# EAGLE design untitled (EAGLE 9.3.0)
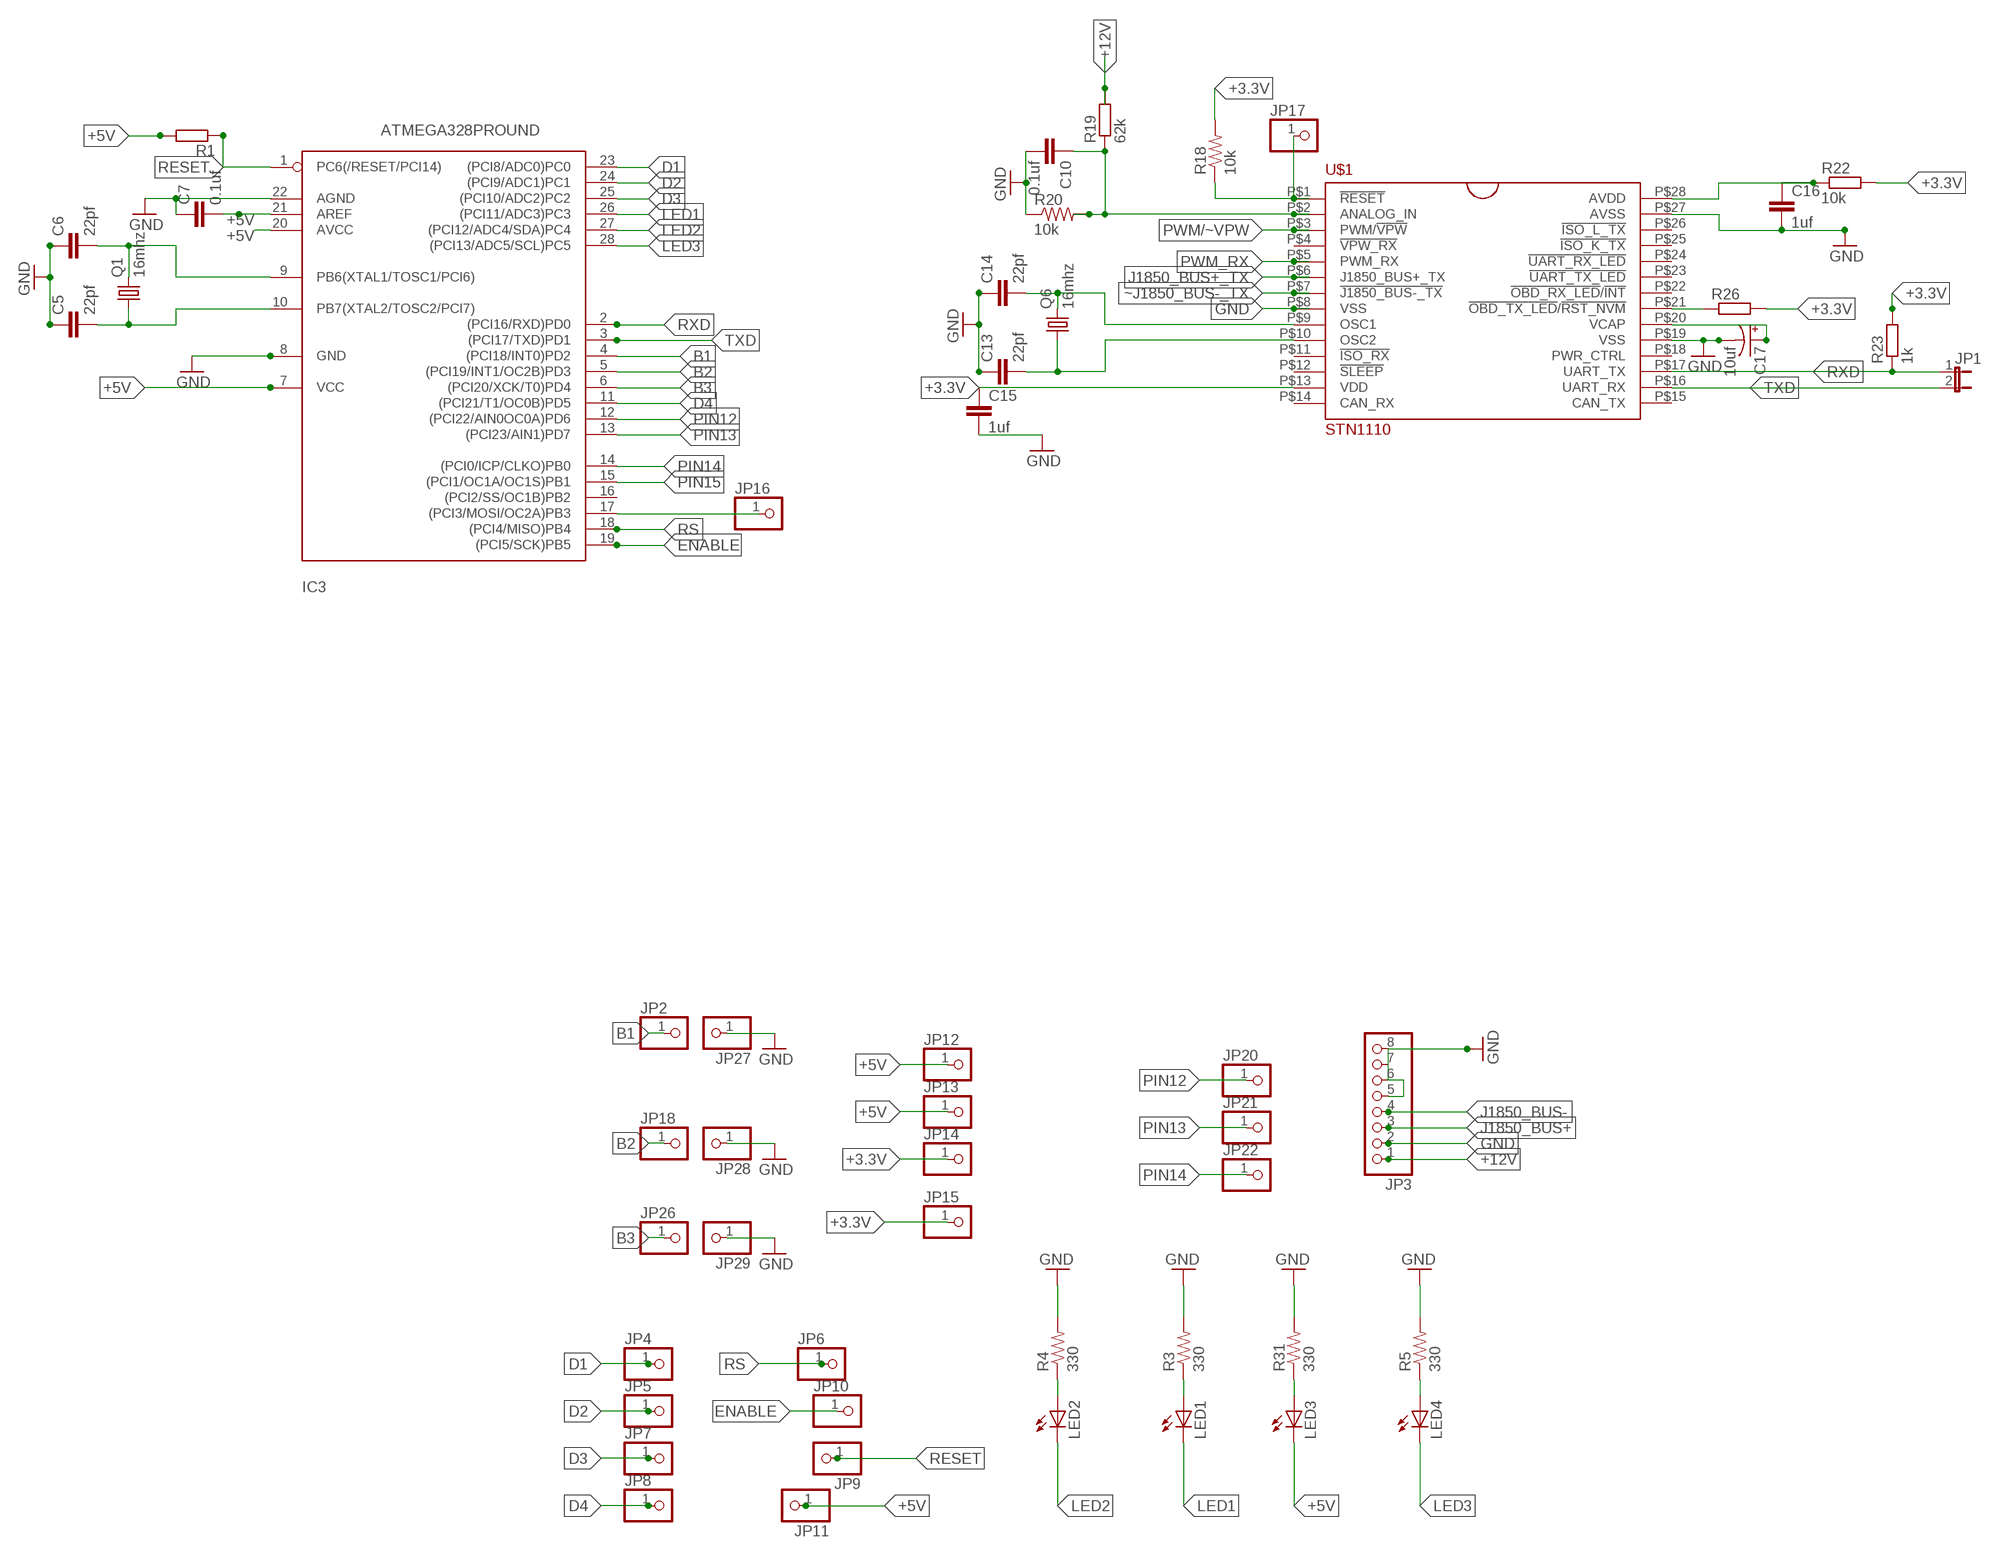
[diagram p0: schematic, sheet 1, part 1 of 2]
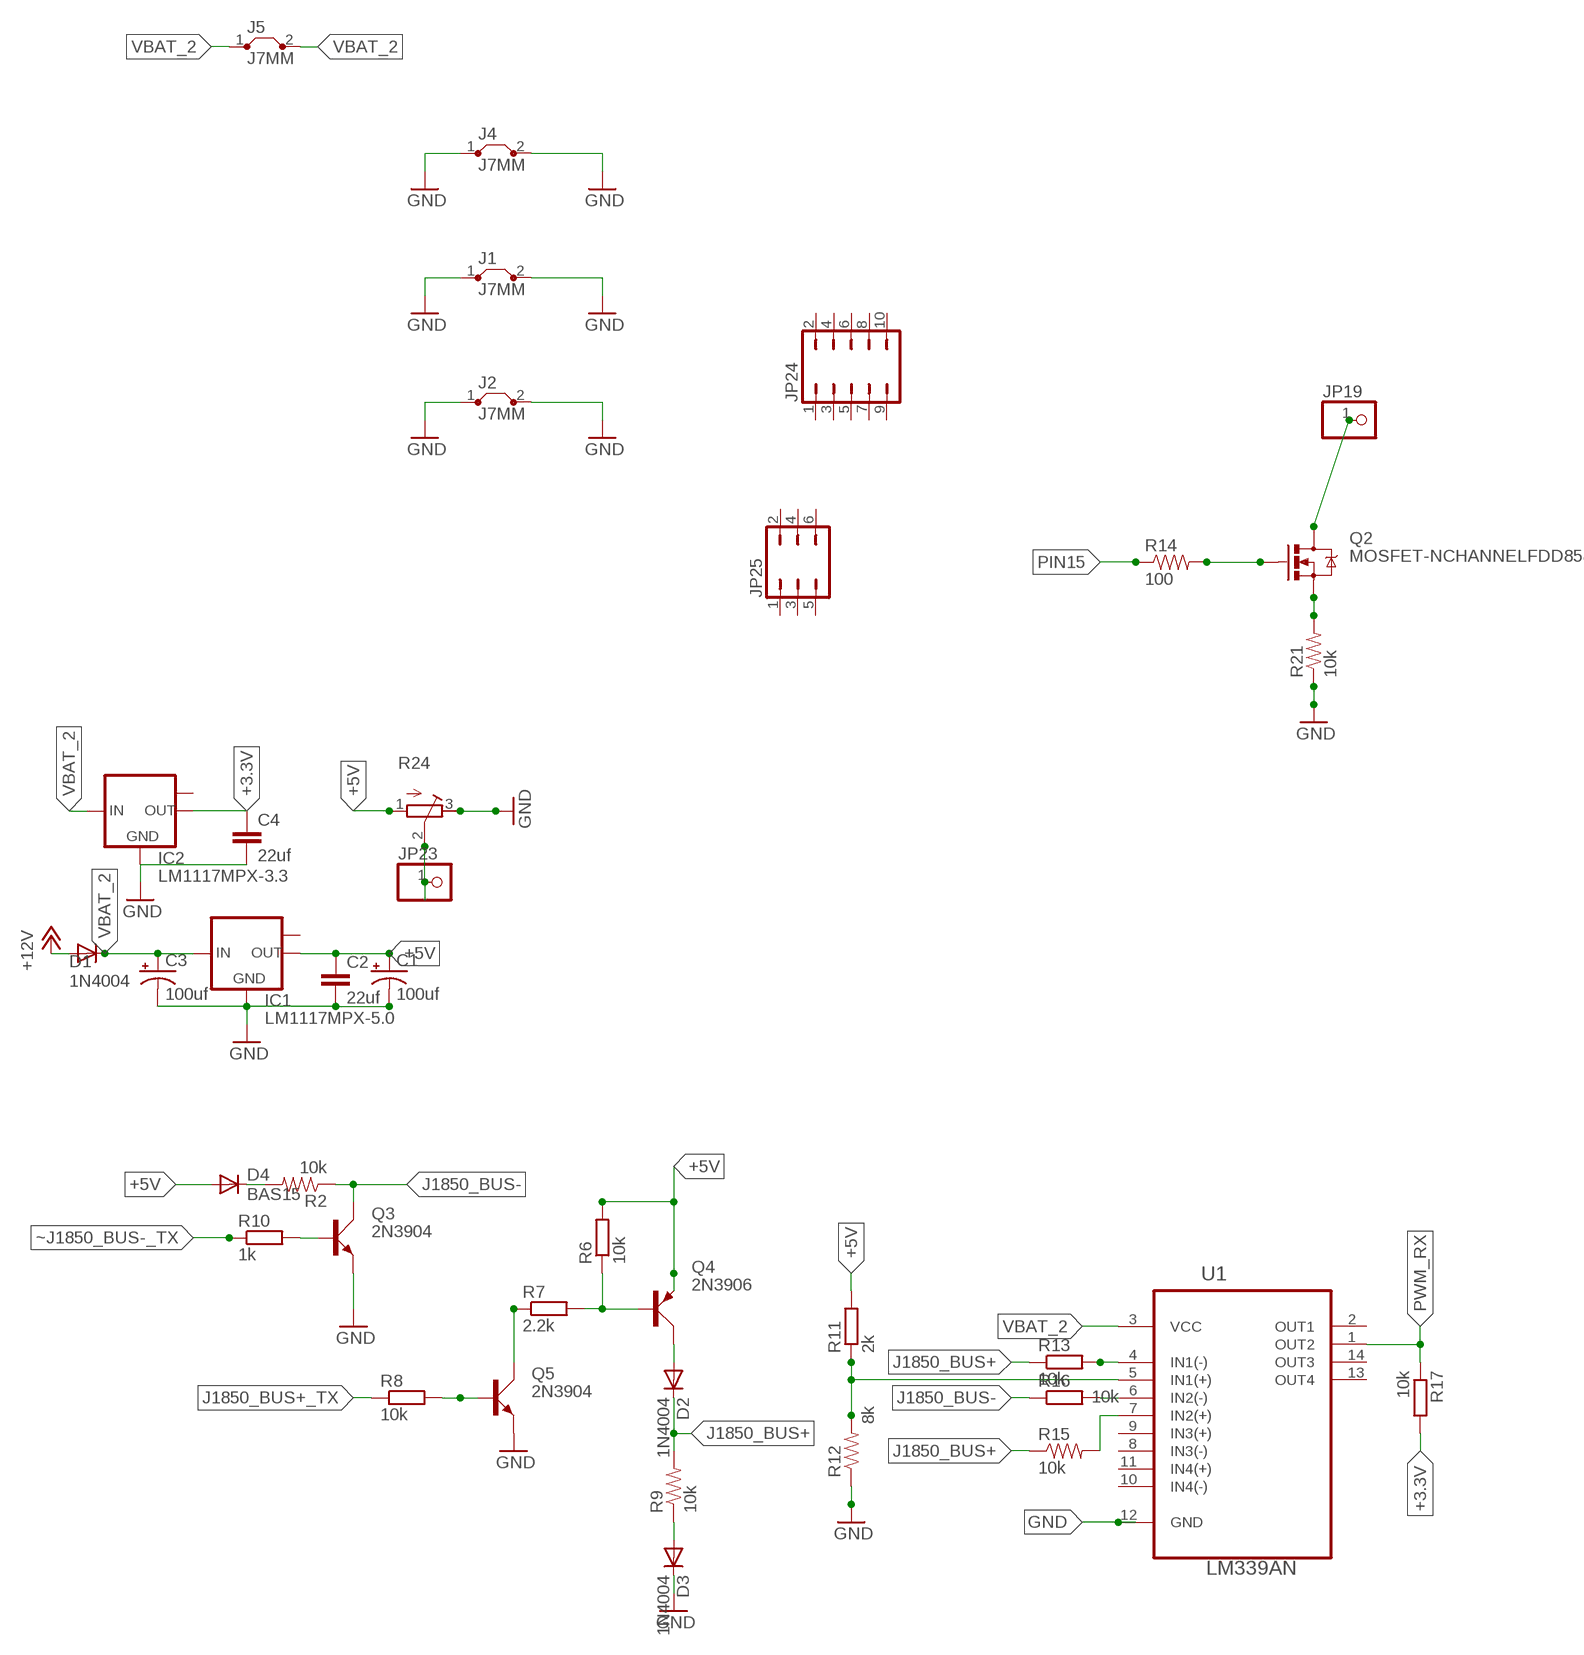
[diagram p1: schematic, sheet 1, part 2 of 2]

## Parts
C1  100uf  10UF-25V-20%(PTH)KIT  [CPOL-RADIAL-10UF-25V-KIT]
C2  22uf  C-EU025-025X050  [C025-025X050]
C3  100uf  10UF-25V-20%(PTH)KIT  [CPOL-RADIAL-10UF-25V-KIT]
C4  22uf  C-EU025-025X050  [C025-025X050]
C5  22pf  CAPPTH  [CAP-PTH-SMALL]
C6  22pf  CAPPTH  [CAP-PTH-SMALL]
C7  0.1uf  C5/4.5  [C5B4.5]
C10  0.1uf  C-EU025-025X050  [C025-025X050]
C13  22pf  CAPPTH  [CAP-PTH-SMALL]
C14  22pf  CAPPTH  [CAP-PTH-SMALL]
C15  1uf  C-EU025-025X050  [C025-025X050]
C16  1uf  C-EU025-025X050  [C025-025X050]
C17  10uf  CAP_POLPTH2  [CPOL-RADIAL-10UF-25V]
D1  1N4004  [DO41-10]
D2  1N4004  [DO41-10]
D3  1N4004  [DO41-10]
D4  BAS15  [DO34-7]
IC1  LM1117MPX-5.0  [SOT223]
IC2  LM1117MPX-3.3  [SOT223]
IC3  ATMEGA328PROUND  [DIL28-3-ROUND]
J1  J7MM  [07]
J2  J7MM  [07]
J4  J7MM  [07]
J5  J7MM  [07]
JP1  JP1E  [JP1]
JP2  PINHD-1X1  [1X01]
JP3  PINHD-1X8  [1X08]
JP4  PINHD-1X1  [1X01]
JP5  PINHD-1X1  [1X01]
JP6  PINHD-1X1  [1X01]
JP7  PINHD-1X1  [1X01]
JP8  PINHD-1X1  [1X01]
JP9  PINHD-1X1  [1X01]
JP10  PINHD-1X1  [1X01]
JP11  PINHD-1X1  [1X01]
JP12  PINHD-1X1  [1X01]
JP13  PINHD-1X1  [1X01]
JP14  PINHD-1X1  [1X01]
JP15  PINHD-1X1  [1X01]
JP16  PINHD-1X1  [1X01]
JP17  PINHD-1X1  [1X01]
JP18  PINHD-1X1  [1X01]
JP19  PINHD-1X1  [1X01]
JP20  PINHD-1X1  [1X01]
JP21  PINHD-1X1  [1X01]
JP22  PINHD-1X1  [1X01]
JP23  PINHD-1X1  [1X01]
JP24  JP5Q  [JP5Q]
JP25  JP3Q  [JP3Q]
JP26  PINHD-1X1  [1X01]
JP27  PINHD-1X1  [1X01]
JP28  PINHD-1X1  [1X01]
JP29  PINHD-1X1  [1X01]
LED1  LED3MM  [LED3MM]
LED2  LED3MM  [LED3MM]
LED3  LED5MM  [LED5MM]
LED4  LED3MM  [LED3MM]
Q1  16mhz  CRYSTALHC49S  [HC49/S]
Q2  MOSFET-NCHANNELFDD8580  [DPAK]
Q3  2N3904  [TO92D]
Q4  2N3906  [TO92D]
Q5  2N3904  [TO92D]
Q6  16mhz  CRYSTALHC49S  [HC49/S]
R1  R-EU_0207/12  [0207/12]
R2  10k  1KOHM-1/4W-1%(PTH)VERT-KIT  [AXIAL-0.1EZ]
R3  330  RESISTORPTH-1/4W-VERT-KIT  [AXIAL-0.1EZ]
R4  330  RESISTORPTH-1/4W-VERT-KIT  [AXIAL-0.1EZ]
R5  330  RESISTORPTH-1/4W-VERT-KIT  [AXIAL-0.1EZ]
R6  10k  R-EU_0204/7  [0204/7]
R7  2.2k  R-EU_0207/12  [0207/12]
R8  10k  R-EU_0207/10  [0207/10]
R9  10k  10KOHM-1/4W-1%(PTH)VERT-KIT  [AXIAL-0.1EZ]
R10  1k  R-EU_0207/12  [0207/12]
R11  2k  R-EU_0207/10  [0207/10]
R12  8k  10KOHM-1/4W5%(PTH)VERT-KIT  [AXIAL-0.1EZ]
R13  10k  R-EU_0207/10  [0207/10]
R14  100  10KOHM-1/4W-1%(PTH)VERT-KIT  [AXIAL-0.1EZ]
R15  10k  10KOHM-1/4W5%(PTH)VERT-KIT  [AXIAL-0.1EZ]
R16  10k  R-EU_0207/10  [0207/10]
R17  10k  R-EU_0207/12  [0207/12]
R18  10k  10KOHM-1/4W5%(PTH)HORIZ-KIT  [AXIAL-0.3EZ]
R19  62k  R-EU_0207/12  [0207/12]
R20  10k  1KOHM-1/4W-1%(PTH)VERT-KIT  [AXIAL-0.1EZ]
R21  10k  10KOHM-1/4W5%(PTH)VERT-KIT  [AXIAL-0.1EZ]
R22  10k  R-EU_0204/7  [0204/7]
R23  1k  R-EU_0207/10  [0207/10]
R24  R-TRIMM74W  [RTRIM74W]
R26  R-EU_M3516  [M3516]
R31  330  RESISTORPTH-1/4W-VERT-KIT  [AXIAL-0.1EZ]
U1  LM339AN  [DIP254P762X508-14]
U$1  STN1110  [SPDIP28]

## Nets
+3.3V: C4.1 C15.1 IC2.2(OUT) JP14.1 JP15.1 R17.2 R18.P$2 R22.2 R23.2 R26.2 U$1.P$13(VDD)
+5V: C1.1(+) C2.1 C7.2 D4.A IC1.2(OUT) IC3.7(VCC) IC3.20(AVCC) IC3.21(AREF) JP11.1 JP12.1 JP13.1 LED3.K(C) Q4.E R1.2 R6.2 R11.2 R24.1(E)
+12V: D1.A JP3.1 R19.2
AAA: C10.1 R19.1 R20.P$2 U$1.P$2(ANALOG_IN)
B1: IC3.4((PCI18/INT0)PD2) JP2.1
B2: IC3.5((PCI19/INT1/OC2B)PD3) JP18.1
B3: IC3.6((PCI20/XCK/T0)PD4) JP26.1
D1: IC3.23((PCI8/ADC0)PC0) JP4.1
D2: IC3.24((PCI9/ADC1)PC1) JP5.1
D3: IC3.25((PCI10/ADC2)PC2) JP7.1
D4: IC3.11((PCI21/T1/OC0B)PD5) JP8.1
ENABLE: IC3.19((PCI5/SCK)PB5) JP10.1
GND: C1.2(-) C2.2 C3.2(-) C4.2 C5.1 C6.1 C7.1 C10.2 C13.1 C14.1 C15.2 C16.2 C17.2(-) D3.C IC1.1(GND) IC2.1(GND) IC3.8(GND) IC3.22(AGND) J1.1 J1.2 J2.1 J2.2 J4.1 J4.2 JP3.2 JP3.5 JP3.6 JP3.7 JP3.8 JP27.1 JP28.1 JP29.1 Q3.E Q5.E R3.P$2 R4.P$2 R5.P$2 R12.P$1 R20.P$1 R21.P$1 R24.3(A) R31.P$2 U1.12(GND) U$1.P$8(VSS) U$1.P$19(VSS) U$1.P$27(AVSS)
J1850_BUS+: D2.C JP3.3 R9.P$2 R13.1 R15.P$1
J1850_BUS+_TX: R8.1 U$1.P$6(J1850_BUS+_TX)
J1850_BUS-: JP3.4 Q3.C R2.P$1 R16.1
LED1: IC3.26((PCI11/ADC3)PC3) LED1.K(C)
LED2: IC3.27((PCI12/ADC4/SDA)PC4) LED2.K(C)
LED3: IC3.28((PCI13/ADC5/SCL)PC5) LED4.K(C)
N$1: R26.1 U$1.P$21(!OBD_TX_LED!/!RST_NVM!)
N$2: D4.C R2.P$2
N$3: Q4.B R6.1 R7.2
N$4: R13.2 U1.4(IN1(-))
N$8: Q5.C R7.1
N$9: D2.A Q4.C
N$10: Q5.B R8.2
N$11: Q3.B R10.2
N$12: D3.A R9.P$1
N$13: R15.P$2 U1.7(IN2(+))
N$14: C16.1 R22.1 U$1.P$28(AVDD)
N$16: R16.2 U1.6(IN2(-))
N$20: C6.2 IC3.9(PB6(XTAL1/TOSC1/PCI6)) Q1.2
N$22: R11.1 R12.P$2 U1.5(IN1(+))
N$23: C5.2 IC3.10(PB7(XTAL2/TOSC2/PCI7)) Q1.1
N$26: C17.1(+) U$1.P$20(VCAP)
N$27: C14.2 Q6.2 U$1.P$9(OSC1)
N$28: C13.2 Q6.1 U$1.P$10(OSC2)
N$29: LED3.A R31.P$1
N$31: LED1.A R3.P$1
N$34: JP17.1 R18.P$1 U$1.P$1(!RESET!)
N$38: LED2.A R4.P$1
N$39: LED4.A R5.P$1
N$45: IC3.17((PCI3/MOSI/OC2A)PB3) JP16.1
N$46: Q2.1(G) R14.P$2
N$49: Q2.3(S) R21.P$2
N$50: JP23.1 R24.2(S)
N$51: JP19.1 Q2.4(D)
PIN12: IC3.12((PCI22/AIN0OC0A)PD6) JP20.1
PIN13: IC3.13((PCI23/AIN1)PD7) JP21.1
PIN14: IC3.14((PCI0/ICP/CLKO)PB0) JP22.1
PIN15: IC3.15((PCI1/OC1A/OC1S)PB1) R14.P$1
PWM/~VPW: U$1.P$3(PWM/!VPW!)
PWM_RX: R17.1 U1.1(OUT2) U$1.P$5(PWM_RX)
RESET: IC3.1(PC6(/RESET/PCI14)) JP9.1 R1.1
RS: IC3.18((PCI4/MISO)PB4) JP6.1
RXD: IC3.2((PCI16/RXD)PD0) JP1.1 R23.1 U$1.P$17(UART_TX)
TXD: IC3.3((PCI17/TXD)PD1) JP1.2 U$1.P$16(UART_RX)
VBAT_2: C3.1(+) D1.C IC1.3(IN) IC2.3(IN) J5.1 J5.2 U1.3(VCC)
~J1850_BUS-_TX: R10.1 U$1.P$7(!J1850_BUS-_TX!)
Unconnected: IC1.TAB(OUT1) IC2.TAB(OUT1) IC3.16((PCI2/SS/OC1B)PB2) JP24.1 JP24.2 JP24.3 JP24.4 JP24.5 JP24.6 JP24.7 JP24.8 JP24.9 JP24.10 JP25.1 JP25.2 JP25.3 JP25.4 JP25.5 JP25.6 U1.2(OUT1) U1.8(IN3(-)) U1.9(IN3(+)) U1.10(IN4(-)) U1.11(IN4(+)) U1.13(OUT4) U1.14(OUT3) U$1.P$4(!VPW_RX!) U$1.P$11(!ISO_RX!) U$1.P$12(!SLEEP!) U$1.P$14(CAN_RX) U$1.P$15(CAN_TX) U$1.P$18(PWR_CTRL) U$1.P$22(!OBD_RX_LED!/!INT!) U$1.P$23(!UART_TX_LED!) U$1.P$24(!UART_RX_LED!) U$1.P$25(!ISO_K_TX!) U$1.P$26(!ISO_L_TX!)

## Library data of the parts
C1 C3 = SparkFun-Capacitors:10UF-25V-20%(PTH): CAP-08440; PROD_ID: CAP-08440
C2 C4 C10 C15 C16 = resistor:C-EU: CAPACITOR, European symbol
C5 C6 C13 C14 = SparkFun-Capacitors:CAP: Capacitor Standard 0603 ceramic capacitor, and 0.1" leaded capacitor.
C7 = capacitor-wima:C: CAPACITOR naming: grid - package width
C17 = SparkFun-Capacitors:CAP_POL: Capacitor Polarized These are standard SMD and PTH capacitors. Normally 10uF, 47uF, and 100uF in electrolytic and tantalum varieties. Always verify the external diameter of the through hole cap, it varies with capacity, voltage, and manufacturer. The EIA devices should be standard.
D1-D3 = diode:1N4004: DIODE general purpose rectifier, 1 A
D4 = diode:BAS15: DIODE high speed
IC1 IC2 = lm1117:LM1117MPX-*
IC3 = atmega328:ATMEGA328*P: MICROCONTROLLER 32 kBytes FLASH 2 kBytes SRAM 1 kBytes EEPROM USART 8-channel 10 bit ADC
J1 J2 J4 J5 = jumper1:J: Bridge
JP1 = jumper:JP1E: JUMPER
JP2 JP4-JP23 JP26-JP29 = pinhead:PINHD-1X1: PIN HEADER
JP3 = pinhead:PINHD-1X8: PIN HEADER
JP24 = jumper:JP5Q: JUMPER
JP25 = jumper:JP3Q: JUMPER
LED1-LED4 = led:LED: LED OSRAM: - CHIPLED LG R971, LG N971, LY N971, LG Q971, LY Q971, LO R971, LY R971 LH N974, LH R974 LS Q976, LO Q976, LY Q976 LO Q996 - Hyper CHIPLED LW Q18S LB Q993, LB Q99A, LB R99A - SideLED LS A670, LO A670, LY A670, LG A670, LP A670 LB A673, LV A673, LT A673, LW A673 LH A674 LY A675 LS A676, LA A676, LO A676, LY A676, LW A676 LS A679, LY A679, LG A679 - Hyper Micro SIDELED® LS Y876, LA Y876, LO Y876, LY Y876 LT Y87S - SmartLED LW L88C, LW L88S LB L89C, LB L89S, LG L890 LS L89K, LO L89K, LY L89K LS L896, LA L896, LO L896, LY L896 - TOPLED LS T670, LO T670, LY T670, LG T670, LP T670 LSG T670, LSP T670, LSY T670, LOP T670, LYG T670 LG T671, LOG T671, LSG T671 LB T673, LV T673, LT T673, LW T673 LH T674 LS T676, LA T676, LO T676, LY T676, LB T676, LH T676, LSB T676, LW T676 LB T67C, LV T67C, LT T67C, LS T67K, LO T67K, LY T67K, LW E67C LS E67B, LA E67B, LO E67B, LY E67B, LB E67C, LV E67C, LT E67C LW T67C LS T679, LY T679, LG T679 LS T770, LO T770, LY T770, LG T770, LP T770 LB T773, LV T773, LT T773, LW T773 LH T774 LS E675, LA E675, LY E675, LS T675 LS T776, LA T776, LO T776, LY T776, LB T776 LHGB T686 LT T68C, LB T68C - Hyper Mini TOPLED® LB M676 - Mini TOPLED Santana® LG M470 LS M47K, LO M47K, LY M47K Source: http://www.osram.convergy.de LUXEON: - LUMILED® LXK2-PW12-R00, LXK2-PW12-S00, LXK2-PW14-U00, LXK2-PW14-V00 LXK2-PM12-R00, LXK2-PM12-S00, LXK2-PM14-U00 LXK2-PE12-Q00, LXK2-PE12-R00, LXK2-PE12-S00, LXK2-PE14-T00, LXK2-PE14-U00 LXK2-PB12-K00, LXK2-PB12-L00, LXK2-PB12-M00, LXK2-PB14-N00, LXK2-PB14-P00, LXK2-PB14-Q00 LXK2-PR12-L00, LXK2-PR12-M00, LXK2-PR14-Q00, LXK2-PR14-R00 LXK2-PD12-Q00, LXK2-PD12-R00, LXK2-PD12-S00 LXK2-PH12-R00, LXK2-PH12-S00 LXK2-PL12-P00, LXK2-PL12-Q00, LXK2-PL12-R00 Source: www.luxeon.com KINGBRIGHT: KA-3528ASYC Source: www.kingbright.com
Q1 Q6 = crystal:CRYSTAL: CRYSTAL; OC_FARNELL: 1667008; OC_NEWARK: unknown
Q2 = fets:MOSFET-NCHANNEL: Generic NMOS footprint
Q3 Q5 = transistor-small-signal:2N3904: NPN TRANSISTOR
Q4 = transistor-small-signal:2N3906: PNP TRANSISTOR
R1 = resistor:R-EU_: RESISTOR, European symbol
R2 R20 = SparkFun-Resistors:1KOHM-1/4W-1%(PTH): RES-12182; PROD_ID: RES-12182; VALUE: 1K
R3-R5 R31 = SparkFun-Resistors:RESISTOR: Resistor Basic schematic elements and footprints for 0603, 1206, and PTH resistors.
R6-R8 R10 R11 R13 R16 R17 R19 R22 R23 R26 = rcl:R-EU_: RESISTOR, European symbol
R9 = SparkFun-Resistors:10KOHM-1/4W-1%(PTH): RES-12183; PROD_ID: RES-12183
R12 = SparkFun-Resistors:10KOHM-1/4W5%(PTH): RES-09435; PROD_ID: RES-9435; VALUE: 10k
R14 = SparkFun-Resistors:10KOHM-1/4W-1%(PTH): RES-12183; PROD_ID: RES-12183; VALUE: 10k
R15 R18 R21 = SparkFun-Resistors:10KOHM-1/4W5%(PTH): RES-09435; PROD_ID: RES-9435
R24 = resistor:R-TRIMM: Trimm resistor
U1 = Fairchild_By_element14_Batch_1:LM339AN: Comparator; MPN: LM339AN; OC_FARNELL: 1564966; OC_NEWARK: 58K8938; PACKAGE: PDIP-14; SUPPLIER: Fairchild
U$1 = scantool:STN1110: STN1110 Multiprotocol OBD to UART Interpreter Datasheet can be downloaded from Scanntool <http://www.scantool.net/scantool/downloads/97/stn1110-ds.pdf>.

## Net classes
0 default: width 0.6 mm, drill 0.8 mm, clearance 1 mm

## Board
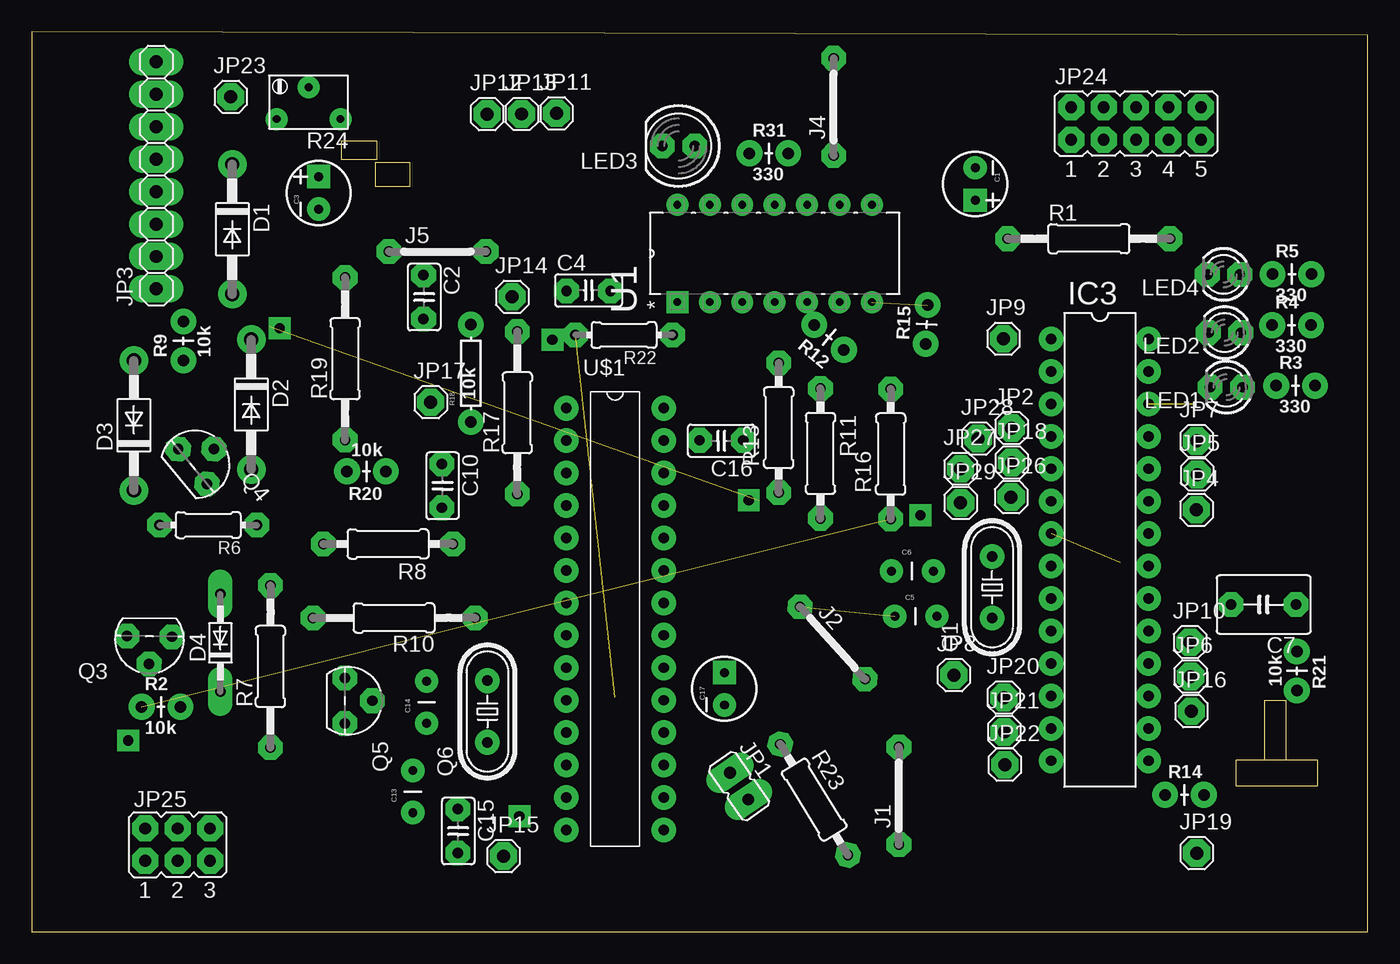
[diagram p2: board, top side]
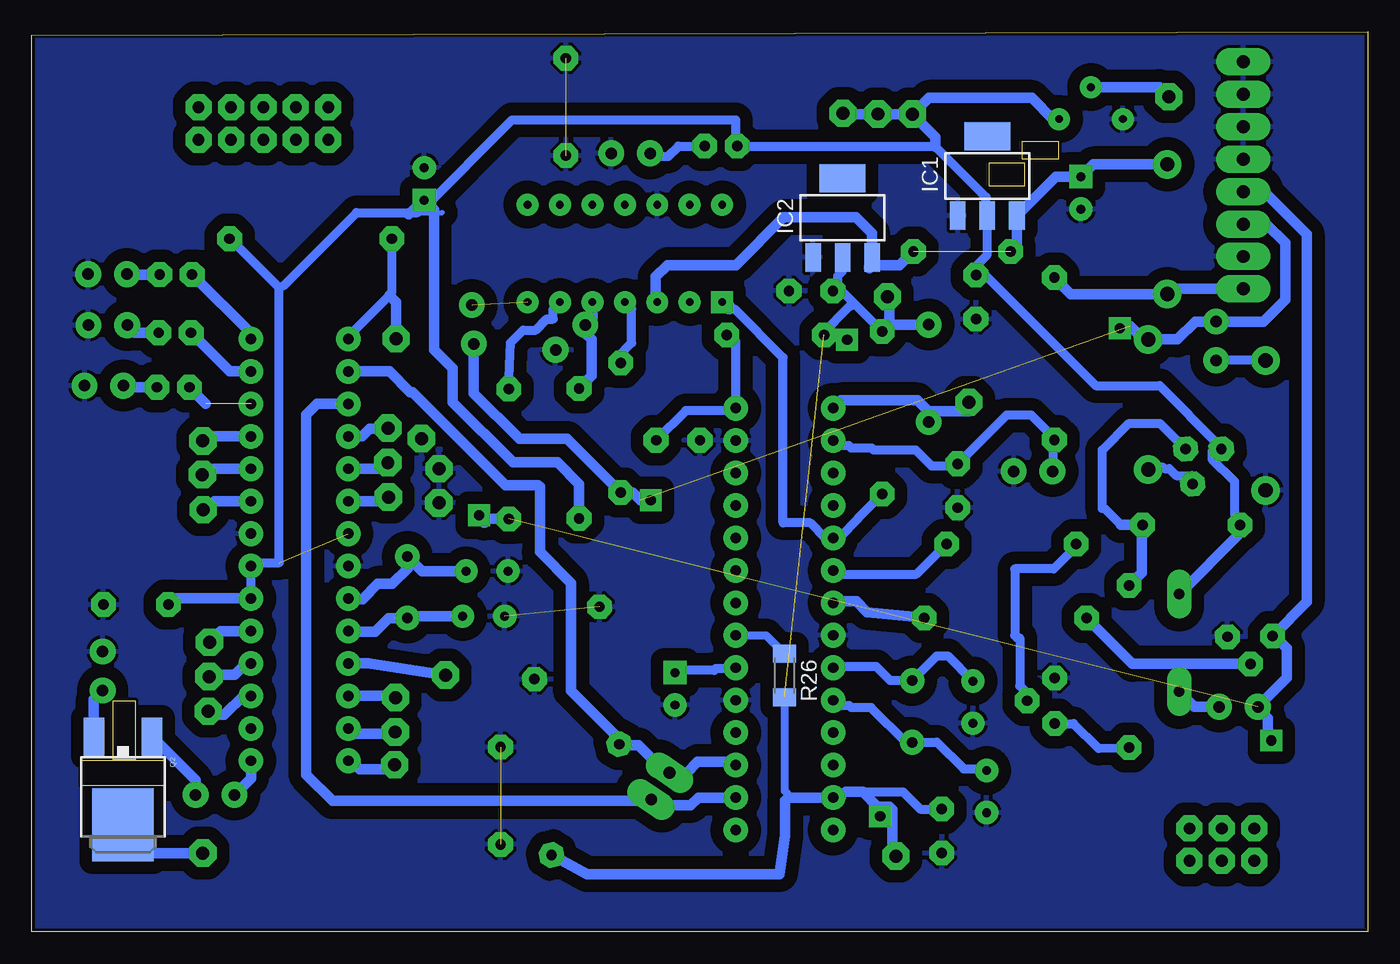
[diagram p3: board, bottom side, seen from below]

Size 104.6 x 70.45 mm. Coordinates in mm from the lower left corner, seen from the top.
Outline: 0,0 104.6,0 104.6,70.2 0,70.45 0,0
Copper layers (1*16): Top 0.035mm / dielectric 1.5mm / Bottom 0.035mm
Design rules "default *": minimum track width 0.9mm, minimum drill 0.9mm, track to track 15mil, track to pad 15mil, pad to pad 15mil, via to via 8mil, smd to smd 8mil, copper to edge 10mil, drill to drill 8mil, minimum pad ring 22mil, minimum via ring 18mil, stop-mask expansion 4mil, vias tented up to drill 10mil, thermal gap 10mil

### Footprints (pad centres in the part's own frame; a part is rotated, then mirrored left to right if it is on the bottom)
CPOL-RADIAL-10UF-25V-KIT = drill 0.7 pad 1.651 square: 1 1.27,0 | drill 0.7 pad 1.651: 2 -1.27,0
C025-025X050 = drill 0.813 octagon: 1 -1.52,-0.05; 2 1.92,-0.05
CAP-PTH-SMALL = drill 0.7 pad 1.651: 1 -0.3,0; 2 2.99,0
C5B4.5 = drill 0.813 pad 1.6 octagon: 1 -2.54,0; 2 2.54,0
CPOL-RADIAL-10UF-25V = drill 0.7 pad 1.651 square: 1 1.27,0 | drill 0.7 pad 1.651: 2 -1.27,0
DO41-10 = drill 1.118: A 5.08,0; C -5.08,0
DO34-7 = drill 0.813 long: A 3.81,0; C -3.81,0
SOT223 = smd 1.219 x 2.235: 1 -2.311,-3.099; 2 0,-3.099; 3 2.311,-3.099 | smd 3.6 x 2.2: TAB 0,3.099
DIL28-3-ROUND = drill 0.813 pad 1.676: 1 -16.51,-3.81; 2 -13.97,-3.81; 3 -11.43,-3.81; 4 -8.89,-3.81; 5 -6.35,-3.81; 6 -3.81,-3.81; 7 -1.27,-3.81; 8 1.27,-3.81; 9 3.81,-3.81; 10 6.35,-3.81; 11 8.89,-3.81; 12 11.43,-3.81; 13 13.97,-3.81; 14 16.51,-3.81; 15 16.51,3.81; 16 13.97,3.81; 17 11.43,3.81; 18 8.89,3.81; 19 6.35,3.81; 20 3.81,3.81; 21 1.27,3.81; 22 -1.27,3.81; 23 -3.81,3.81; 24 -6.35,3.81; 25 -8.89,3.81; 26 -11.43,3.81; 27 -13.97,3.81; 28 -16.51,3.81
07 = drill 0.813 pad 1.6 octagon: 1 -3.81,0; 2 3.81,0
JP1 = drill 0.914 long: 1 0,-1.27; 2 0,1.27
1X01 = drill 1.016 octagon: 1 0,0
1X08 = drill 1.016 long: 1 -8.89,0; 2 -6.35,0; 3 -3.81,0; 4 -1.27,0; 5 1.27,0; 6 3.81,0; 7 6.35,0; 8 8.89,0
JP5Q = drill 0.914 octagon: 1 -5.08,-1.27; 2 -5.08,1.27; 3 -2.54,-1.27; 4 -2.54,1.27; 5 0,-1.27; 6 0,1.27; 7 2.54,-1.27; 8 2.54,1.27; 9 5.08,-1.27; 10 5.08,1.27
JP3Q = drill 0.914 octagon: 1 -2.54,-1.27; 2 -2.54,1.27; 3 0,-1.27; 4 0,1.27; 5 2.54,-1.27; 6 2.54,1.27
LED3MM = drill 0.813 octagon: A -1.27,0; K 1.27,0
LED5MM = drill 0.813 octagon: A -1.27,0; K 1.27,0
HC49/S = drill 0.813: 1 -2.413,0; 2 2.413,0
DPAK = smd 1.6 x 3: 1 -2.28,-5.31; 3 2.28,-5.31 | smd 4.826 x 5.715: 4 0,1.588
TO92D = drill 0.813 octagon: B 0,1.905; C 1.77,-0.25; E -1.77,-0.25
0207/12 = drill 0.813 octagon: 1 -6.35,0; 2 6.35,0
AXIAL-0.1EZ = drill 0.9 pad 1.88: P$1 -0.25,0; P$2 2.79,0
0204/7 = drill 0.813 octagon: 1 -3.81,0; 2 3.81,0
0207/10 = drill 0.813 octagon: 1 -5.08,0; 2 5.08,0
AXIAL-0.3EZ = drill 0.9 pad 1.88: P$1 -3.81,0; P$2 3.81,0
RTRIM74W = drill 0.61: 1 -1.25,-2.5; 2 1.25,0; 3 -1.25,2.5
M3516 = smd 1.4 x 1.8: 1 -1.7,0; 2 1.7,0
DIP254P762X508-14 = drill 0.6 pad 1.27 square: 1 -7.62,15.24 | drill 0.6 pad 1.27: 2 -7.62,12.7; 3 -7.62,10.16; 4 -7.62,7.62; 5 -7.62,5.08; 6 -7.62,2.54; 7 -7.62,0; 8 0,0; 9 0,2.54; 10 0,5.08; 11 0,7.62; 12 0,10.16; 13 0,12.7; 14 0,15.24
SPDIP28 = drill 0.813 pad 1.524: P$1 -3.81,16.51; P$2 -3.81,13.97; P$3 -3.81,11.43; P$4 -3.81,8.89; P$5 -3.81,6.35; P$6 -3.81,3.81; P$7 -3.81,1.27; P$8 -3.81,-1.27; P$9 -3.81,-3.81; P$10 -3.81,-6.35; P$11 -3.81,-8.89; P$12 -3.81,-11.43; P$13 -3.81,-13.97; P$14 -3.81,-16.51; P$15 3.81,-16.51; P$16 3.81,-13.97; P$17 3.81,-11.43; P$18 3.81,-8.89; P$19 3.81,-6.35; P$20 3.81,-3.81; P$21 3.81,-1.27; P$22 3.81,1.27; P$23 3.81,3.81; P$24 3.81,6.35; P$25 3.81,8.89; P$26 3.81,11.43; P$27 3.81,13.97; P$28 3.81,16.51

### Placement (x,y rotation side)
C1  73.87,58.55 270 top
C2  30.72,49.89 270 top
C3  22.45,57.85 90 top
C4  43.39,50.22 0 top
C5  67.87,24.7 0 top
C6  67.61,28.25 0 top
C7  96.46,25.62 180 top
C10  32.16,35.12 270 top
C13  29.83,9.64 90 top
C14  30.9,16.64 90 top
C15  33.39,8.09 270 top
C16  54.2,38.44 180 top
C17  54.23,19.03 90 top
D1  15.69,55.01 270 top
D2  17.18,41.28 270 top
D3  7.98,39.65 90 top
D4  14.76,22.62 90 top
IC1  29.78,59.17 0 bottom
IC2  41.12,55.91 0 bottom
IC3  83.64,29.9 270 top
J1  67.9,10.65 90 top
J2  62.7,22.61 312 top
J4  62.78,64.58 90 top
J5  31.75,53.26 0 top
JP1  55.38,11.41 214.5 top
JP2  76.72,39.44 0 top
JP3  9.74,59.22 90 top
JP4  91.19,33.04 0 top
JP5  91.25,35.8 0 top
JP6  90.73,19.98 0 top
JP7  91.21,38.43 0 top
JP8  72.2,20.1 0 top
JP9  76.08,46.43 0 top
JP10  90.69,22.68 0 top
JP11  41.09,64.08 0 top
JP12  35.64,64.02 0 top
JP13  38.35,64.03 0 top
JP14  37.61,49.71 0 top
JP15  36.93,5.93 0 top
JP16  90.8,17.28 0 top
JP17  31.23,41.46 0 top
JP18  76.72,36.74 0 top
JP19  91.21,6.17 0 top
JP20  76.11,18.34 0 top
JP21  76.14,15.64 0 top
JP22  76.19,13.09 0 top
JP23  15.56,65.37 0 top
JP24  86.47,63.28 0 top
JP25  11.41,6.83 0 top
JP26  76.68,34.03 0 top
JP27  72.72,36.25 0 top
JP28  74.09,38.62 0 top
JP29  72.73,33.58 0 top
LED1  93.55,42.63 180 top
LED2  93.4,46.9 180 top
LED3  50.65,61.52 180 top
LED4  93.33,51.46 180 top
Q1  75.2,26.98 90 top
Q2  97.47,9.95 180 bottom
Q3  9.2,22.88 179.1 top
Q4  12.77,36.59 309.5 top
Q5  24.75,18.09 270 top
Q6  35.67,17.25 90 top
R1  82.77,54.26 0 top
R2  8.85,17.61 0 top
R3  97.69,42.76 0 top
R4  97.38,47.49 0 top
R5  97.41,51.49 0 top
R6  13.81,31.84 180 top
R7  18.68,20.77 90 top
R8  27.89,30.36 180 top
R9  11.86,44.99 90 top
R10  28.36,24.57 180 top
R11  61.75,37.45 270 top
R12  63.4,45.73 139.8 top
R13  58.48,39.47 90 top
R14  88.99,10.73 0 top
R15  70.01,46.28 87.2 top
R16  67.25,37.41 90 top
R17  38.01,40.63 90 top
R18  34.38,43.73 90 top
R19  24.53,44.87 90 top
R20  27.47,36.05 180 top
R21  99.06,21.69 270 top
R22  46.37,46.73 180 top
R23  61.26,10.35 301.4 top
R24  21.66,64.88 90 top
R26  45.66,20.08 270 bottom
R31  56.44,60.94 0 top
U1  65.79,56.92 90 top
U$1  45.67,24.48 0 top

### Tracks (layer width: path | path; a pad name or v marks a point on that pad's centre or on a via)
+3.3V  (1 unrouted)
  Bottom 0.61: R26.2 45.66,11.03 45.14,10.52
  Bottom 0.7: C15.1 35.03,9.61 36.38,10.96 40.83,10.96 41.28,10.51 41.83,10.51 U$1.P$13 | IC2.2 41.13,52.76 41.13,51.71 41.48,51.36 41.48,50.56 41.53,50.56 41.88,50.21 C4.1 41.33,50.26 41.28,50.26 40.26,49.23 | 40.26,49.23 R17.2 | R22.2 42.78,46.76 40.53,49.01 40.48,49.01 40.26,49.23
  Bottom 0.813: R18.P$2 37.46,47.53 | 37.46,47.53 R17.2 | U$1.P$13 45.14,10.52 45.38,10.52 45.62,10.27 45.62,7.54 46.05,4.52 61.13,4.52 R23.2 | 40.83,10.96 39.52,10.96 38.37,9.81 37.46,9.81 37.21,9.56 37.21,6.21 JP15.1 | R22.2 41.45,46.73 41.44,46.74 | 37.46,47.53 37.46,49.56 JP14.1
+5V  (1 unrouted)
  Bottom 0.406: 74.38,56.31 72.44,56.31
  Bottom 0.7: IC3.20 87.48,26.11 87.48,28.61 IC3.21 87.23,28.91 85.23,28.91 85.23,50.41 | R6.2 10.03,31.86 10.03,32.31 10.43,32.71 10.43,35.26 12.18,37.01 12.18,37.61 11.63,37.61 11.48,37.76 Q4.E 11.63,38.11 16.28,42.76 21.28,42.76 29.93,51.41 C2.1 30.63,51.41 30.63,52.16 29.78,53.01 29.78,56.06 IC1.2 29.88,56.41 29.88,57.51 33.83,61.46 49.28,61.46 49.33,61.51 LED3.K 49.48,61.86 49.48,63.56 66.98,63.56 74.08,56.46 74.38,56.31 74.98,56.31 79.18,56.31 84.93,50.56 85.23,50.41 | 85.23,50.41 89.08,54.26 R1.2
  Bottom 0.813: 10.03,31.86 10.03,31.16 D4.A | 87.48,26.11 93.44,26.11 C7.2 | 33.83,61.46 33.83,62.21 JP12.1 | JP12.1 JP13.1 41.03,64.03 JP11.1 | 74.98,56.31 75.09,56.2 C1.1 73.12,56.52 73.12,45.59 71.65,44.12 71.65,41.47 66.93,36.75 63.45,36.75 61.75,35.06 R11.2 | R24.1 24.64,63.63 26.3,65.29 34.37,65.29 JP12.1
+12V
  Bottom 0.813: JP3.1 15.28,50.33 D1.A 23.24,49.92 R19.2
AAA
  Bottom 0.7: U$1.P$2 41.83,38.41 41.48,38.06 40.63,38.06 40.43,37.86 38.83,37.86 38.68,37.71 35.38,37.71 34.13,36.46 32.38,36.46 C10.1 32.08,36.66 28.28,40.46 26.33,40.46 24.48,38.61 24.48,38.56 R19.1 24.63,38.21 24.63,36.06 R20.P$2
B1
  Bottom 0.813: IC3.4 78.75,38.79 78.16,39.38 76.78,39.38 JP2.1
B2
  Bottom 0.813: IC3.5 77.21,36.25 JP18.1
B3
  Bottom 0.813: IC3.6 77,33.71 JP26.1
D1
  Bottom 0.813: IC3.23 90.3,33.71 91.44,32.58 91.44,32.8 JP4.1
D2
  Bottom 0.813: IC3.24 90.81,36.25 JP5.1
D3
  Bottom 0.813: IC3.25 90.85,38.79 JP7.1
D4
  Bottom 0.813: IC3.11 78.25,21.01 JP8.1
ENABLE
  Bottom 0.813: IC3.19 89.81,23.55 JP10.1
GND  (3 unrouted)
  Bottom 0.7: IC3.22 87.48,31.21 87.48,31.17 | U$1.P$8 41.88,23.21 U$1.P$8
  pour Bottom: -3.81,102.87 -3.81,-5.08 167.64,-5.08 167.64,102.87
J1850_BUS+  (1 unrouted)
  Bottom 0.813: JP3.3 7.93,55.41 6.46,53.93 6.46,49.48 8.18,47.75 11.84,47.75 R9.P$2 13.5,47.78 14.91,46.37 17.17,46.37 D2.C 17.55,46.37 18.59,47.4 | 56.93,33.77 57.54,34.38 R13.1 62.69,38.59 66.43,38.59 70,42.16 R15.P$1
J1850_BUS+_TX
  Bottom 0.7: R8.1 32.98,30.36 35.33,28.01 41.08,28.01 41.33,28.26 41.83,28.26 U$1.P$6
J1850_BUS-  (1 unrouted)
  Bottom 0.813: JP3.4 8.1,57.95 4.76,54.62 4.76,25.82 Q3.C 7.26,23.15 6.32,22.21 6.32,19.89 R2.P$1 8.6,17.5 7.81,16.72 7.81,15.73 7.84,15.71 | R16.1 68.9,32.33 69.19,32.03 69.14,32.03
LED1  (1 unrouted)
  Bottom 0.813: 90.97,41.33 LED1.K
LED2
  Bottom 0.813: IC3.27 89.1,43.87 LED2.K
LED3
  Bottom 0.813: IC3.28 87.45,46.85 LED4.K
N$1
  Bottom 0.61: U$1.P$21 47.09,23.21 R26.1
N$2
  Bottom 0.813: R2.P$2 13.56,17.61 D4.C
N$3
  Bottom 0.7: Q4.B 14.28,37.81 16.28,39.81 18.68,39.81 20.78,37.71 20.78,33.16 20.63,33.16 19.33,31.86 17.98,31.86 R6.1
  Bottom 0.813: 19.33,31.86 17.79,31.86 17.69,31.76 17.69,28.11 R7.2
N$4
  Bottom 0.7: U1.4 58.13,49.26 57.63,48.76 57.63,46.11 58.78,44.96 58.78,44.51 58.73,44.51 R13.2
N$8
  Bottom 0.7: R7.1 21.08,14.36 23.03,16.31 24.48,16.31 Q5.C
N$9
  Bottom 0.7: Q4.C 13.73,35.11 13.73,35.71 14.98,35.71 15.53,36.26 15.93,36.26 16.08,36.41 16.93,36.41 17.13,36.21 D2.A
N$10
  Bottom 0.7: Q5.B 26.68,18.11 26.68,18.71 27.23,19.26 27.23,23.01 27.43,23.01 27.63,23.21 27.63,28.41 24.58,28.41 22.83,30.16 22.83,30.36 R8.2
N$11
  Bottom 0.813: Q3.B 18.41,20.97 R10.2
N$12
  Bottom 0.7: R9.P$1 11.83,44.76 9.03,44.76 8.98,44.71 7.98,44.71 D3.A
N$13  (1 unrouted)
N$14
  Bottom 0.7: R22.1 50.38,46.71 49.88,46.21 49.48,46.21 U$1.P$28 49.78,40.81 53.38,40.81 55.68,38.51 C16.1
N$16
  Bottom 0.7: R16.2 67.13,46.11 66.13,47.11 65.13,47.11 64.28,47.96 63.78,47.96 63.78,48.76 63.28,49.26 U1.6
N$20
  Bottom 0.813: C6.2 74.06,28.25 Q1.2 75.2,28.44 76.39,27.24 77.51,27.24 78.71,26.05 79.78,26.05 IC3.9
N$22
  Bottom 0.813: U1.5 60.71,48.09 R12.P$2 61.27,46.87 60.77,46.38 60.77,43.52 R11.1
N$23
  Bottom 0.813: C5.2 75.06,24.7 Q1.1 76.68,24.56 77.74,23.51 79.78,23.51 IC3.10
N$25  (via drill 0.8 pad 1.68)
  other vias: 7.55,14.98
N$26
  Bottom 0.7: C17.1 54.08,20.46 51.18,20.46 51.03,20.61 49.53,20.61 49.48,20.66 U$1.P$20
N$27
  Bottom 0.7: C14.2 32.88,21.61 33.73,21.61 35.63,19.71 Q6.2 35.98,19.66 37.38,19.66 38.48,20.76 41.78,20.76 41.83,20.71 U$1.P$9
N$28
  Bottom 0.7: C13.2 29.83,12.66 29.93,12.76 31.63,12.76 33.73,14.86 35.63,14.86 Q6.1 36.03,14.81 36.13,14.81 38.88,17.56 40.43,17.56 40.58,17.71 41.43,17.71 U$1.P$10
N$29
  Bottom 0.7: LED3.A 51.93,61.51 53.98,61.51 54.78,60.71 55.58,60.71 55.78,60.91 56.18,60.91 R31.P$1
N$31
  Bottom 0.813: LED1.A 97.31,42.63 R3.P$1
N$34
  Bottom 0.813: R18.P$1 34.38,40.75 | 34.38,40.75 35.23,41.61 41.24,41.61 U$1.P$1 | 34.38,40.75 31.23,40.75 JP17.1
N$38
  Bottom 0.813: LED2.A 96.55,46.9 R4.P$1
N$39
  Bottom 0.813: LED4.A 97.13,51.46 R5.P$1
N$40  (via drill 0.8 pad 1.68)
  other vias: 69.59,32.61
N$41  (via drill 0.8 pad 1.68)
  other vias: 56.13,33.8
N$42  (via drill 0.8 pad 1.68)
  other vias: 19.39,47.25
N$43  (via drill 0.8 pad 1.68)
  other vias: 38.17,9.05
N$44  (via drill 0.8 pad 1.68)
  other vias: 40.76,46.35
N$45
  Bottom 0.813: IC3.17 88.03,18.47 89.53,16.98 90.5,16.98 JP16.1
N$46
  Bottom 0.813: R14.P$2 91.78,11.85 Q2.1
N$49
  Bottom 0.813: Q2.3 99.75,18.21 R21.P$2
N$50
  Bottom 0.813: R24.2 16.32,66.13 JP23.1
N$51
  Bottom 0.813: JP19.1 96.42,6.17 96.54,6.28 96.54,7.43 Q2.4
PIN12
  Bottom 0.813: IC3.12 76.25,18.47 JP20.1
PIN13
  Bottom 0.813: IC3.13 79.7,15.93 79.28,15.52 76.28,15.52 JP21.1
PIN14
  Bottom 0.813: IC3.14 79.59,13.39 78.94,12.73 76.54,12.73 JP22.1
PIN15
  Bottom 0.813: IC3.15 87.45,12.02 R14.P$1
PWM_RX
  Bottom 0.7: 50.53,49.26 50.03,48.76 50,48.76 49.58,48.76 45.78,44.96 45.78,32.01 43.63,32.01 42.48,30.86 41.88,30.86 U$1.P$5 41.53,30.91 41.33,30.91 39.88,32.36 39.88,32.41 R17.1
  Bottom 0.9: U1.1 50,49 50,48.76
RESET
  Bottom 0.7: IC3.1 79.78,46.41 79.78,46.86 79.58,46.86 76.61,49.84 76.43,50.01 76.43,54.26 R1.1
  Bottom 0.813: 76.61,49.84 76.08,49.3 JP9.1
RS
  Bottom 0.813: IC3.18 87.83,21.01 88.73,20.11 90.61,20.11 JP6.1
RXD
  Bottom 0.813: U$1.P$17 49.72,13.3 52.46,13.3 53.3,12.46 JP1.1 54.94,12.46 57.09,14.61 58.11,14.61 | 58.11,14.61 58.53,14.61 R23.1 | IC3.2 76.6,43.87 74.99,42.26 74.79,42.26 67.51,34.98 64.96,34.98 64.82,34.84 64.82,29.74 62.39,27.31 62.39,18.89 58.11,14.61
TXD
  Bottom 0.813: U$1.P$16 52.41,10.52 53.02,9.91 55.65,9.91 JP1.2 56.21,10.26 81.05,10.26 83.11,12.32 83.11,40.47 82.25,41.33 IC3.3
VBAT_2  (1 unrouted)
  Bottom 0.813: D1.C 21.49,60.09 C3.1 24.42,59.12 IC1.3 27.47,53.73 J5.1 | J5.2 36.65,52.17 38.84,52.17 | IC2.3 38.81,54.68 40.06,55.94 45.74,55.94 49.48,52.2 54.82,52.2 55.76,51.27 55.76,49.43 U1.3
  Bottom 0.9: 38.84,52.17 39,52 IC2.3
~J1850_BUS-_TX
  Bottom 0.813: R10.1 39.2,25.02 40.04,25.86 41.75,25.86 U$1.P$7